# Altium schematic sheet 从机.SchDoc
size A4
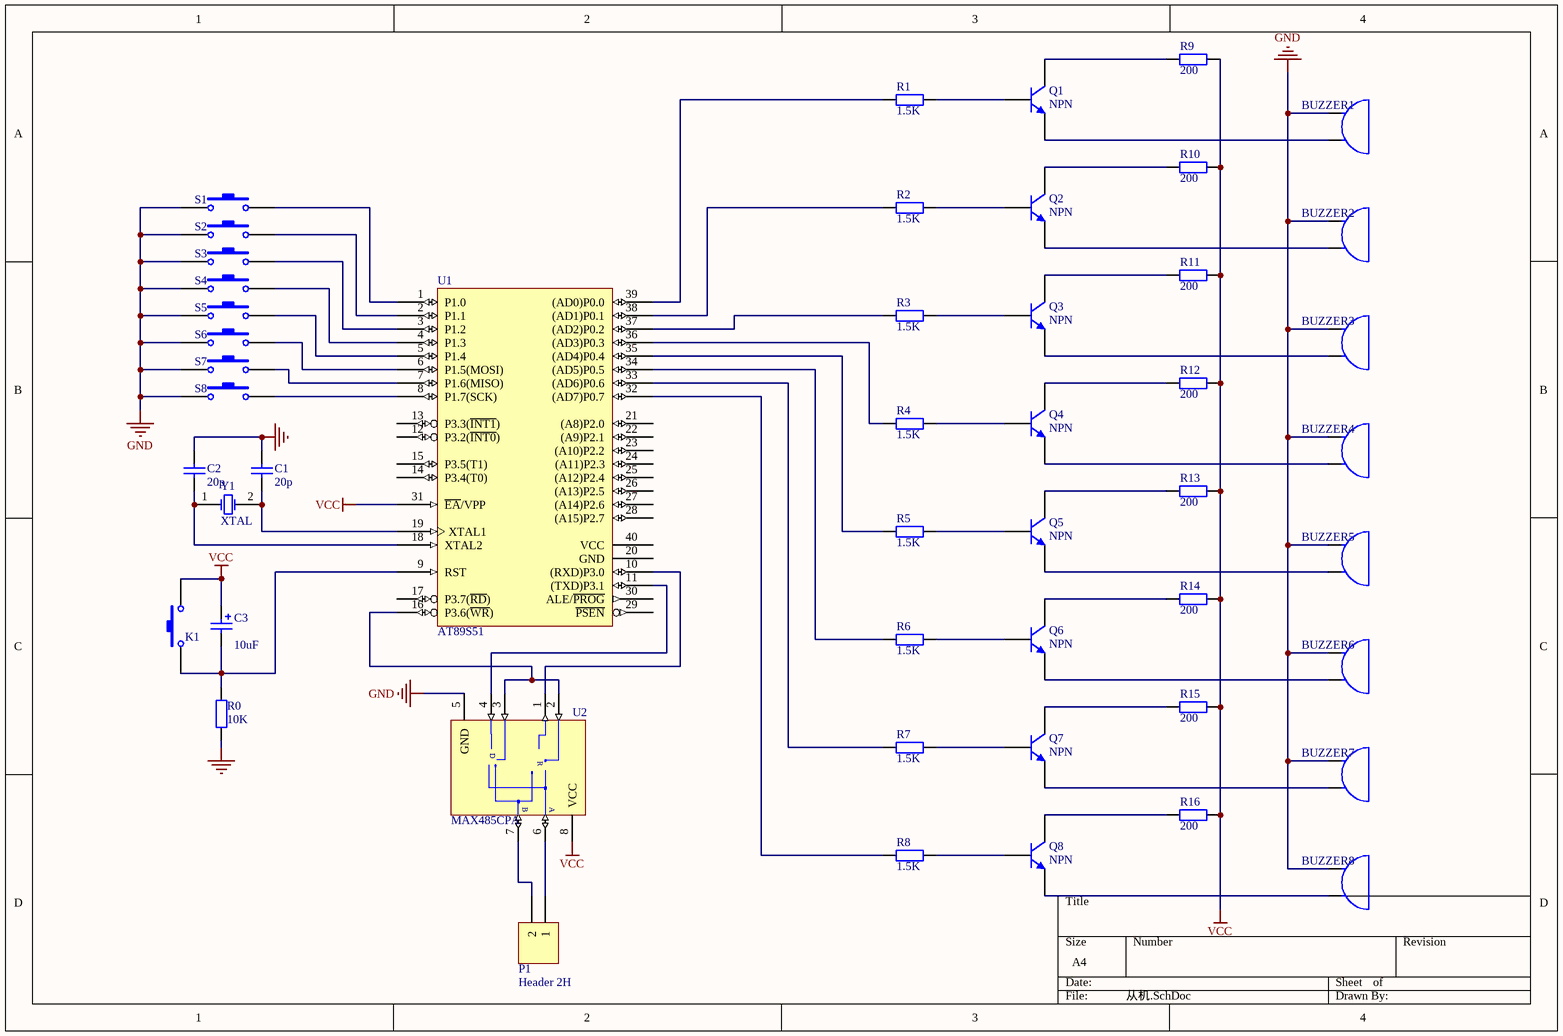
[diagram p0: 从机.SchDoc]

## Parts
BUZZER1  BUZZER  [SP/10/14]  (value not drawn)
BUZZER2  BUZZER  [SP/10/14]  (value not drawn)
BUZZER3  BUZZER  [SP/10/14]  (value not drawn)
BUZZER4  BUZZER  [SP/10/14]  (value not drawn)
BUZZER5  BUZZER  [SP/10/14]  (value not drawn)
BUZZER6  BUZZER  [SP/10/14]  (value not drawn)
BUZZER7  BUZZER  [SP/10/14]  (value not drawn)
BUZZER8  BUZZER  [SP/10/14]  (value not drawn)
C1  value 20p  [RAD-0.3]  (hidden comment: Cap)
C2  value 20p  [RAD-0.3]  (hidden comment: Cap)
C3  value 10uF  [POLAR0.8]  (hidden comment: Cap Pol2)
K1  SW-PB  [SPST-2]  (value not drawn)
P1  Header 2H  [HDR1X2H]
Q1  NPN  [TO-226]
Q2  NPN  [TO-226]
Q3  NPN  [TO-226]
Q4  NPN  [TO-226]
Q5  NPN  [TO-226]
Q6  NPN  [TO-226]
Q7  NPN  [TO-226]
Q8  NPN  [TO-226]
R0  10K  [AXIAL-0.3]
R1  value 1.5K  [AXIAL-0.3]  (hidden comment: 10K)
R2  value 1.5K  [AXIAL-0.3]  (hidden comment: 10K)
R3  value 1.5K  [AXIAL-0.3]  (hidden comment: 10K)
R4  value 1.5K  [AXIAL-0.3]  (hidden comment: 10K)
R5  value 1.5K  [AXIAL-0.3]  (hidden comment: 10K)
R6  value 1.5K  [AXIAL-0.3]  (hidden comment: 10K)
R7  value 1.5K  [AXIAL-0.3]  (hidden comment: 10K)
R8  value 1.5K  [AXIAL-0.3]  (hidden comment: 10K)
R9  200  [AXIAL-0.3]
R10  200  [AXIAL-0.3]
R11  200  [AXIAL-0.3]
R12  200  [AXIAL-0.3]
R13  200  [AXIAL-0.3]
R14  200  [AXIAL-0.3]
R15  200  [AXIAL-0.3]
R16  200  [AXIAL-0.3]
S1  SW-PB  [SPST-2]  (value not drawn)
S2  SW-PB  [SPST-2]  (value not drawn)
S3  SW-PB  [SPST-2]  (value not drawn)
S4  SW-PB  [SPST-2]  (value not drawn)
S5  SW-PB  [SPST-2]  (value not drawn)
S6  SW-PB  [SPST-2]  (value not drawn)
S7  SW-PB  [SPST-2]  (value not drawn)
S8  SW-PB  [SPST-2]  (value not drawn)
U1  AT89S51  [DIP-40]
U2  MAX485CPA  [PA8]
Y1  XTAL  [R38]

## Nets
GND: BUZZER1.1 BUZZER2.1 BUZZER3.1 BUZZER4.1 BUZZER5.1 BUZZER6.1 BUZZER7.1 BUZZER8.1 C1.1 C2.1 R0.2 S1.1 S2.1 S3.1 S4.1 S5.1 S6.1 S7.1 S8.1 U2.5(GND)
VCC: C3.1 K1.2 R9.2 R10.2 R11.2 R12.2 R13.2 R14.2 R15.2 R16.2 U1.31(~{EA}/VPP) U2.8(VCC)
NetBUZZER1_2: BUZZER1.2 Q1.3(E)
NetBUZZER2_2: BUZZER2.2 Q2.3(E)
NetBUZZER3_2: BUZZER3.2 Q3.3(E)
NetBUZZER4_2: BUZZER4.2 Q4.3(E)
NetBUZZER5_2: BUZZER5.2 Q5.3(E)
NetBUZZER6_2: BUZZER6.2 Q6.3(E)
NetBUZZER7_2: BUZZER7.2 Q7.3(E)
NetBUZZER8_2: BUZZER8.2 Q8.3(E)
NetC1_2: C1.2 U1.19(XTAL1) Y1.2(OSC2)
NetC2_2: C2.2 U1.18(XTAL2) Y1.1(OSC1)
NetC3_2: C3.2 K1.1 R0.1 U1.9(RST)
NetP1_1: P1.1 U2.6(A)
NetP1_2: P1.2 U2.7(B)
NetQ1_1: Q1.1(C) R9.1
NetQ1_2: Q1.2(B) R1.2
NetQ2_1: Q2.1(C) R10.1
NetQ2_2: Q2.2(B) R2.2
NetQ3_1: Q3.1(C) R11.1
NetQ3_2: Q3.2(B) R3.2
NetQ4_1: Q4.1(C) R12.1
NetQ4_2: Q4.2(B) R4.2
NetQ5_1: Q5.1(C) R13.1
NetQ5_2: Q5.2(B) R5.2
NetQ6_1: Q6.1(C) R14.1
NetQ6_2: Q6.2(B) R6.2
NetQ7_1: Q7.1(C) R15.1
NetQ7_2: Q7.2(B) R7.2
NetQ8_1: Q8.1(C) R16.1
NetQ8_2: Q8.2(B) R8.2
NetR1_1: R1.1 U1.39((AD0)P0.0)
NetR2_1: R2.1 U1.38((AD1)P0.1)
NetR3_1: R3.1 U1.37((AD2)P0.2)
NetR4_1: R4.1 U1.36((AD3)P0.3)
NetR5_1: R5.1 U1.35((AD4)P0.4)
NetR6_1: R6.1 U1.34((AD5)P0.5)
NetR7_1: R7.1 U1.33((AD6)P0.6)
NetR8_1: R8.1 U1.32((AD7)P0.7)
NetS1_2: S1.2 U1.1(P1.0)
NetS2_2: S2.2 U1.2(P1.1)
NetS3_2: S3.2 U1.3(P1.2)
NetS4_2: S4.2 U1.4(P1.3)
NetS5_2: S5.2 U1.5(P1.4)
NetS6_2: S6.2 U1.6(P1.5(MOSI))
NetS7_2: S7.2 U1.7(P1.6(MISO))
NetS8_2: S8.2 U1.8(P1.7(SCK))
NetU1_10: U1.10((RXD)P3.0) U2.1(RO)
NetU1_11: U1.11((TXD)P3.1) U2.4(DI)
NetU1_16: U1.16(P3.6(~{WR})) U2.2(~{RE}) U2.3(DE)

Not connected (* = marked no-connect by the designer): U1 12(P3.2(~{INT0})) 13(P3.3(~{INT1})) 14(P3.4(T0)) 15(P3.5(T1)) 17(P3.7(~{RD})) 20(GND) 21((A8)P2.0) 22((A9)P2.1) 23((A10)P2.2) 24((A11)P2.3) 25((A12)P2.4) 26((A13)P2.5) 27((A14)P2.6) 28((A15)P2.7) 29(~{PSEN}) 30(ALE/~{PROG}) 40(VCC)

## Notes on the sheet
- (in symbol MAX485CPA) D; R

## Library data of the parts
C1 C2 = Cap: Capacitor; Published: 8-Jun-2000; LatestRevisionDate: 17-Jul-2002; LatestRevisionNote: Re-released for DXP Platform.; PackageReference: RAD-0.3; Publisher: Altium Limited
C3 = Cap Pol2: Polarized Capacitor (Axial); Published: 8-Jun-2000; LatestRevisionDate: 17-Jul-2002; LatestRevisionNote: Re-released for DXP Platform.; PackageReference: POLAR0.8; Publisher: Altium Limited
K1 S1-S8 = SW-PB: Switch; Published: 24-Mar-1999; LatestRevisionDate: 17-Jul-2002; LatestRevisionNote: Re-released for DXP Platform.; PackageReference: SPST-2; Publisher: Altium Limited
P1 = Header 2H: Header, 2-Pin, Right Angle; LatestRevisionDate: 17-Jul-2002; LatestRevisionNote: Re-released for DXP Platform.; Publisher: Altium Limited
Q1-Q8 = NPN: NPN Bipolar Transistor; Published: 8-Jun-2000; LatestRevisionDate: 17-Jul-2002; LatestRevisionNote: Re-released for DXP Platform.; PackageReference: TO-226; Publisher: Altium Limited; Code_JEDEC: TO-226-AA
R0-R16 = Res2: Resistor; Published: 8-Jun-2000; LatestRevisionDate: 17-Jul-2002; LatestRevisionNote: Re-released for DXP Platform.; PackageReference: AXIAL-0.4; Publisher: Altium Limited
  R0: Value: 10K
  R9-R16: Value: 200
U1 = AT89S51: 8-Bit Microcontroller with 4K ISP Flash ROM
U2 = MAX485CPA: Low-Power, Slew-Rate-Limited RS-485/RS-422 Transceiver; Published: 16-Jan-2001; LatestRevisionDate: 06-Jun-2005; LatestRevisionNote: Stylized 3D Model Added.; DatasheetVersion: Feb-1996; PackageVersion: RevB, 21-0043; PackageReference: PA8; Publisher: Altium Limited; PackageDescription: DIP; 8 Leads; Row Spacing 7.62 mm; Pitch 2.54 mm; Code_JEDEC: MS-001-AB; ComponentLink1Description: Manufacturer Link; ComponentLink1URL: http://www.maxim-ic.com/; ComponentLink2Description: Datasheet; ComponentLink2URL: http://pdfserv.maxim-ic.com/en/ds/MAX1487-MAX491.pdf
Y1 = XTAL: Crystal Oscillator; Published: 8-Jun-2000; LatestRevisionDate: 17-Jul-2002; LatestRevisionNote: Re-released for DXP Platform.; PackageReference: R38; Publisher: Altium Limited